# Altium schematic sheet 9.AUX.SchDoc: 6.6kW Daul OBC +11kW WPT
size A3; Date: 23/03/6; Revision: V 1.0; SheetNumber: 14; SheetTotal: 14; PageSetup: Record=PageOptions|CenterHorizontal=True|CenterVertical=True|PrintScale=0.71|XCorrection=1.00|YCorrection=1.00|PrintKind=2|BorderSize=5000000|LeftOffset=0|BottomOffset=0|Orientation=2|PaperLength=1000|PaperWidth=1000|Scale=100|PaperSource=7|PrintQuality=-3|MediaType=1|DitherType=10|PrintScaleMode=1|PaperKind=A4|PaperIndex=9; ImagePath: 0
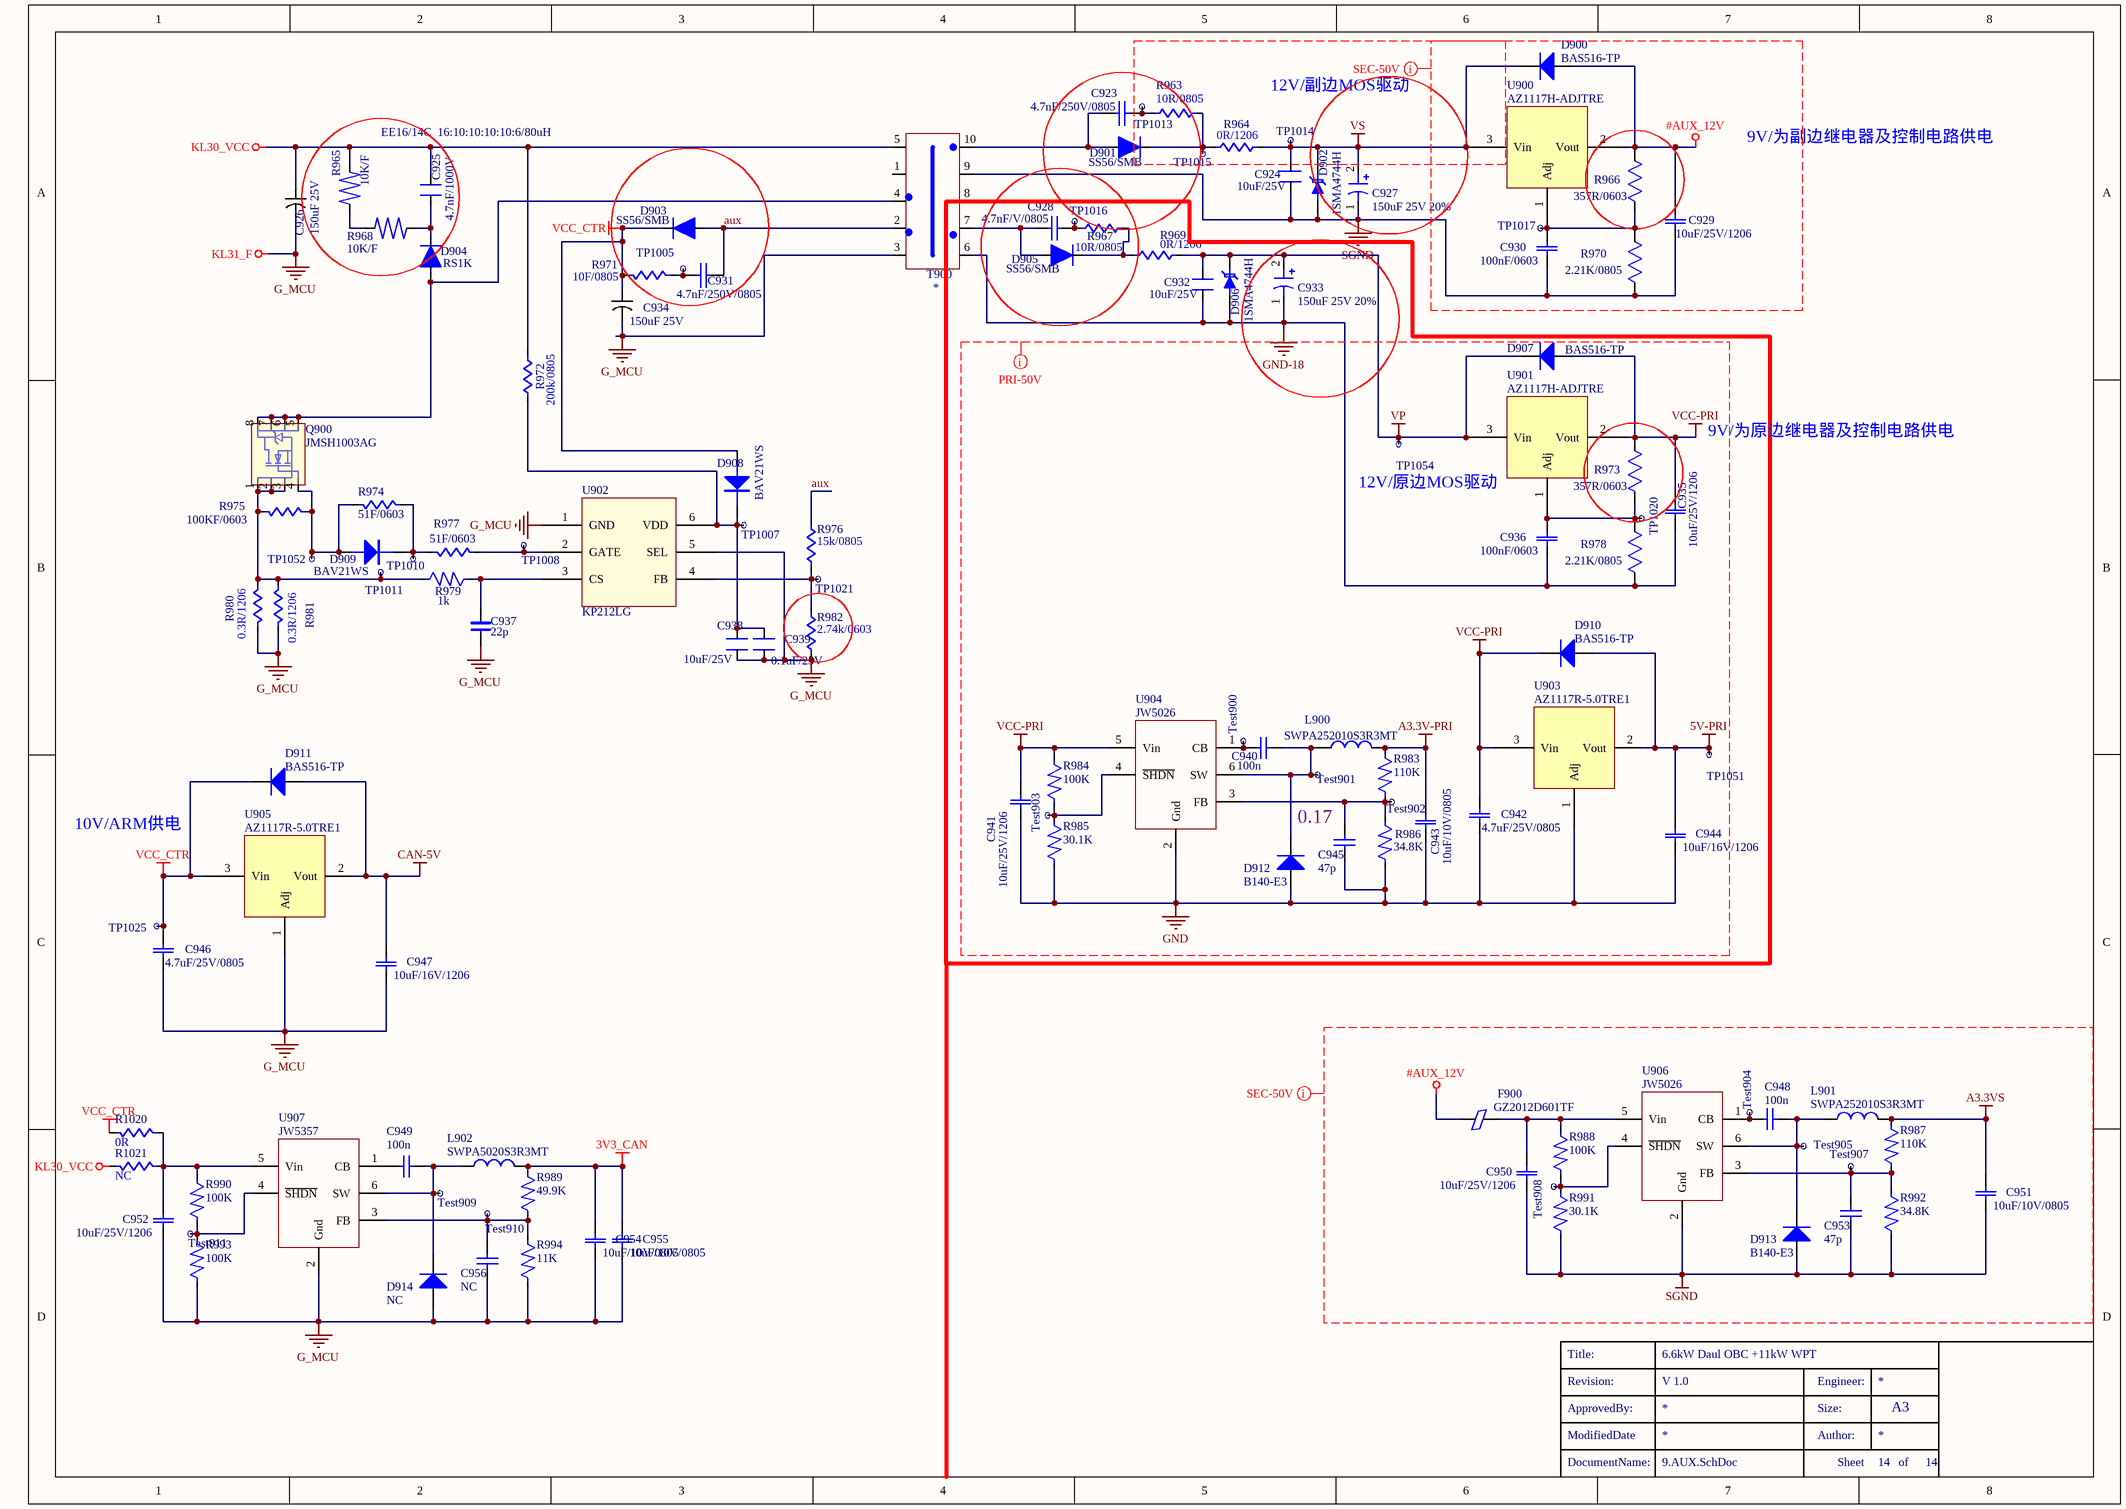
[diagram p0: 9.AUX.SchDoc]

## Parts
C923  4.7nF/250V/0805  [C0805]
C924  10uF/25V  [C1206]
C925  4.7nF/1000V  [C1206]
C926  150uF 25V  [CE_D6_3_L7_7_MVY]
C927  150uF 25V 20%  [CE_D6_3_L7_7_MVY]
C928  4.7nF/V/0805  [C0805]
C929  10uF/25V/1206  [C1206]
C930  100nF/0603  [C0603]
C931  4.7nF/250V/0805  [C0805]
C932  10uF/25V  [C1206]
C933  150uF 25V 20%  [CE_D6_3_L7_7_MVY]
C934  150uF 25V  [CE_D6_3_L7_7_MVY]
C935  10uF/25V/1206  [C1206]
C936  100nF/0603  [C0603]
C937  22p  [C0603]
C938  10uF/25V  [C0805]
C939  0.1uF/25V  [C0603]
C940  100n  [C0402]
C941  10uF/25V/1206  [C1206]
C942  4.7uF/25V/0805  [C0805]
C943  10uf/10V/0805  [C0805]
C944  10uF/16V/1206  [C1206]
C945  47p  [C0402]
C946  4.7uF/25V/0805  [C0805]
C947  10uF/16V/1206  [C1206]
C948  100n  [C0402]
C949  100n  [C0402]
C950  10uF/25V/1206  [C1206]
C951  10uf/10V/0805  [C0805]
C952  10uF/25V/1206  [C1206]
C953  47p  [C0402]
C954  10uf/10V/0805  [C0805]
C955  10uf/10V/0805  [C0805]
C956  NC  [C0402]
D900  BAS516-TP  [D_SOD-523_SC-79]
D901  value SS56/SMB  [DO-214AC]  (hidden comment: ES1J)
D902  1SMA4744H  [DO-214AC]
D903  value SS56/SMB  [DO-214AC]  (hidden comment: ES1J)
D904  RS1K  [DO-214AC]
D905  value SS56/SMB  [DO-214AC]  (hidden comment: ES1J)
D906  1SMA4744H  [DO-214AC]
D907  BAS516-TP  [D_SOD-523_SC-79]
D908  BAV21WS  [D_SOD323]
D909  BAV21WS  [D_SOD323]
D910  BAS516-TP  [D_SOD-523_SC-79]
D911  BAS516-TP  [D_SOD-523_SC-79]
D912  B140-E3  [DO-214AC]
D913  B140-E3  [D_SMA]
D914  NC  [D_SMA]
F900  GZ2012D601TF  [R0805]
L900  SWPA252010S3R3MT  [SWPA252010S]
L901  SWPA252010S3R3MT  [SWPA252010S]
L902  SWPA5020S3R3MT  [IND-SMD_L5.0-W5.0]
Q900  JMSH1003AG  [Q_PG_TDSON_8]
R963  10R/0805  [R0805]
R964  0R/1206  [R1206]
R965  10K/F  [R1206]
R966  357R/0603  [R0603]
R967  10R/0805  [R0805]
R968  10K/F  [R1206]
R969  0R/1206  [R1206]
R970  2.21K/0805  [R0805]
R971  10F/0805  [R1206]
R972  200k/0805  [R0805]
R973  357R/0603  [R0603]
R974  51F/0603  [R0603]
R975  100KF/0603  [R0603]
R976  15k/0805  [R0805]
R977  51F/0603  [R0603]
R978  2.21K/0805  [R0805]
R979  1k  [R0603]
R980  0.3R/1206  [R1206]
R981  0.3R/1206  [R1206]
R982  2.74k/0603  [R0603]
R983  110K  [R0402]
R984  100K  [R0402]
R985  30.1K  [R0402]
R986  34.8K  [R0402]
R987  110K  [R0402]
R988  100K  [R0402]
R989  49.9K  [R0402]
R990  100K  [R0402]
R991  30.1K  [R0402]
R992  34.8K  [R0402]
R993  100K  [R0402]
R994  11K  [R0402]
R1020  0R  [R1206]
R1021  NC  [R1206]
T900  定制磁件  [BOBBIN_10P_EI_25]  (value not drawn)
Test900  测试点  [测试点]  (value not drawn)
Test901  测试点  [测试点]  (value not drawn)
Test902  测试点  [测试点]  (value not drawn)
Test903  测试点  [测试点]  (value not drawn)
Test904  测试点  [测试点]  (value not drawn)
Test905  测试点  [测试点]  (value not drawn)
Test907  测试点  [测试点]  (value not drawn)
Test908  测试点  [测试点]  (value not drawn)
Test909  测试点  [测试点]  (value not drawn)
Test910  测试点  [测试点]  (value not drawn)
Test911  测试点  [测试点]  (value not drawn)
TP1005  测试点  [测试点]  (value not drawn)
TP1007  测试点  [测试点]  (value not drawn)
TP1008  测试点  [测试点]  (value not drawn)
TP1010  测试点  [测试点]  (value not drawn)
TP1011  测试点  [测试点]  (value not drawn)
TP1013  测试点  [测试点]  (value not drawn)
TP1014  测试点  [测试点]  (value not drawn)
TP1015  测试点  [测试点]  (value not drawn)
TP1016  测试点  [测试点]  (value not drawn)
TP1017  测试点  [测试点]  (value not drawn)
TP1020  测试点  [测试点]  (value not drawn)
TP1021  测试点  [测试点]  (value not drawn)
TP1025  测试点  [测试点]  (value not drawn)
TP1051  测试点  [测试点]  (value not drawn)
TP1052  测试点  [测试点]  (value not drawn)
TP1054  测试点  [测试点]  (value not drawn)
U900  AZ1117H-ADJTRE  [SOT-223]
U901  AZ1117H-ADJTRE  [SOT-223]
U902  KP212LG  [SOT-23_6]
U903  AZ1117R-5.0TRE1  [SOT89_MI]
U904  JW5026  [SOT-23_6]
U905  AZ1117R-5.0TRE1  [SOT89_MI]
U906  JW5026  [SOT-23_6]
U907  JW5357  [SOT-23_6]

## Blocks framed on the sheet
0.17: C928 C932 C933 C935 C936 C940-C945 D905-D907 D910 D912 L900 R967 R969 R973 R978 R983-R986 Test900-Test903 TP1016 TP1020 TP1051 TP1054 U901 U903 U904

## Nets
3V3_CAN: C954.2 C955.2 L902.2 R989.1
5V-PRI: C944.2 D910.A TP1051.1 U903.2(Vout)
#AUX_12V: C929.2 D900.A F900.1 R966.1 U900.2(Vout)
A3.3V-PRI: C943.2 L900.2 R983.1
A3.3VS: C951.2 L901.2 R987.1
CAN-5V: C947.2 D911.A U905.2(Vout)
G_MCU: C926.1(-) C934.1(-) C937.2 C938.2 C939.2 C946.1 C947.1 C952.1 C954.1 C955.1 C956.1 D914.A R980.1 R981.1 R982.1 R993.2 R994.2 T900.3 U902.1(GND) U902.5(SEL) U905.1(Adj) U907.2(Gnd)  [also labelled KL31_F]
GND: C941.1 C942.1 C943.1 C944.1 C945.1 D912.A R985.2 R986.2 U903.1(Adj) U904.2(Gnd)
GND-18: C932.1 C933.1 C935.1 C936.2 D906.A R978.2 T900.6
KL30_VCC: C925.2 C926.2(+) R965.2 R972.1 R1021.2 T900.5
SGND: C924.1 C927.1 C929.1 C930.2 C950.1 C951.1 C953.1 D902.A D913.A R970.2 R991.2 R992.2 T900.9 U906.2(Gnd)
VCC-PRI: C935.2 C941.2 C942.2 D907.A D910.K R973.1 R984.1 U901.2(Vout) U903.3(Vin) U904.5(Vin)
VCC_CTR: C934.2(+) C946.2 D903.K D908.A D911.K R971.1 R1020.2 TP1025.1 U905.3(Vin)
VP: C932.2 C933.2 D906.K D907.K R969.2 TP1054.1 U901.3(Vin)
VS: C924.2 C927.2 D900.K D902.K R964.2 TP1014.1 U900.3(Vin)
aux: C931.1 D903.A R976.2 T900.2
NetC923_1: C923.1 D901.A T900.10
NetC923_2: C923.2 R963.1 TP1013.1
NetC925_1: C925.1 D904.K R968.1
NetC928_1: C928.1 D905.A T900.7
NetC928_2: C928.2 R967.1 TP1016.1
NetC930_1: C930.1 R966.2 R970.1 TP1017.1 U900.1(Adj)
NetC931_2: C931.2 R971.2 TP1005.1
NetC936_1: C936.1 R973.2 R978.1 TP1020.1 U901.1(Adj)
NetC937_1: C937.1 R979.1 U902.3(CS)
NetC938_1: C938.1 C939.1 D908.K R972.2 TP1007.1 U902.6(VDD)
NetC940_1: C940.1 D912.K L900.1 Test901.1 U904.6(SW)
NetC940_2: C940.2 Test900.1 U904.1(CB)
NetC945_2: C945.2 R983.2 R986.1 Test902.1 U904.3(FB)
NetC948_1: C948.1 D913.K L901.1 Test905.1 U906.6(SW)
NetC948_2: C948.2 Test904.1 U906.1(CB)
NetC949_1: C949.1 D914.K L902.1 Test909.1 U907.6(SW)
NetC949_2: C949.2 U907.1(CB)
NetC950_2: C950.2 F900.2 R988.1 U906.5(Vin)
NetC952_2: C952.2 R990.1 R1020.1 R1021.1 U907.5(Vin)
NetC953_2: C953.2 R987.2 R992.1 Test907.1 U906.3(FB)
NetC956_2: C956.2 R989.2 R994.1 Test910.1 U907.3(FB)
NetD901_K: D901.K R963.2 R964.1 TP1015.1
NetD904_A: D904.A Q900.5(D) Q900.6(D) Q900.7(D) Q900.8(D) T900.4
NetD905_K: D905.K R967.2 R969.1
NetD909_A: D909.A Q900.4(G) R974.2 R975.2 TP1052.1
NetD909_K: D909.K R974.1 R977.2 TP1010.1
NetQ900_1: Q900.1(S) Q900.2(S) Q900.3(S) R975.1 R979.2 R980.2 R981.2 TP1011.1
NetR965_1: R965.1 R968.2
NetR976_1: R976.1 R982.2 TP1021.1 U902.4(FB)
NetR977_1: R977.1 TP1008.1 U902.2(GATE)
NetR984_2: R984.2 R985.1 Test903.1 U904.4(~{SHDN})
NetR988_2: R988.2 R991.1 Test908.1 U906.4(~{SHDN})
NetR990_2: R990.2 R993.1 Test911.1 U907.4(~{SHDN})

Not connected (* = marked no-connect by the designer): T900 1 8

## Layout directives
net class SEC-50V: #AUX_12V, A3.3VS, SGND
net class PRI-50V: 5V-PRI, A3.3V-PRI, GND, VCC-PRI, VP

## Notes on the sheet
- 12V/副边MOS驱动
- EE16/14C  16:10:10:10:10:6/80uH
- 9V/为副边继电器及控制电路供电
- 9V/为原边继电器及控制电路供电
- (near TP1054) 12V/原边MOS驱动
- 10V/ARM供电
- Revision:
- Title:
- Engineer:
- ModifiedDate
- ApprovedBy:
- Author:
- Size:
- A3
- DocumentName:
- Sheet
- of
- (in symbol CAP0603) 10uF/10V/0805

## Library data of the parts
C923 C928 C931 = C0805: Capacitor SMD
C924 C925 C932 C938 C939 = C-A: Chip
  C924 C932 C938: Value: 10uF/25V
  C925: Value: 4.7nF/1000V
  C939: Value: 0.1uF/25V
C926 C934 = CAP AL
C927 C933 = CAP_Ecap: Manufacturer: Panasonic; Manufacturer P/N: EEEFK1E151P; DIP/SMD: SMD
C929 C930 C935 C936 = CAP0603: Manufacturer: {Manufacturer}; Manufacturer P/N: {Manufacturer P/N}; Package: {Package}
  C929 C935: VALUE: 10uF/25V/1206
  C930 C936: VALUE: 100nF/0603
C937 = CAP_GENERAL: VALUE: 22p
C940 C945 C948 C949 C953 C956 = CAP
  C940 C948 C949: VALUE: 100n
  C945 C953: VALUE: 47p
  C956: VALUE: NC
C941-C944 C946 C947 C950-C952 C954 C955 = CAP0603: Manufacturer: {Manufacturer}; Manufacturer P/N: {Manufacturer P/N}; DIP/SMD: SMD; Top/Bottom: Top; Package: {Package}; Part Number: *
  C941 C950 C952: VALUE: 10uF/25V/1206
  C942 C946: VALUE: 4.7uF/25V/0805
  C944 C947: VALUE: 10uF/16V/1206
D900 D907 = DIODE_MICRO: DIODE RECTIFIER; VALUE: BAS516-TP
D901 D903-D905 = D-DO214AC-A
  D904: Value: RS1K
D902 D906 = TVS: Manufacturer: Taiwan Semiconductor; DIP/SMD: SMD; Manufacturer P/N: 1SMA4744H
D908 D909 = DIODE
D910 D911 = DIODE_MICRO: 75V 250mA SOD-523 MCC; DIP/SMD: SMD; Top/Bottom: Top; VALUE: BAS516-TP; Part Number: *
D912-D914 = DIODE_MICRO: DIODE RECTIFIER; DIP/SMD: SMD; Top/Bottom: Bottom; BQ-CCCP: BQ-CCCP
  D912 D913: VALUE: B140-E3
  D914: VALUE: NC
F900 = Ferrite Bead 220±25％Ω@100MHz 2.2A 0.05Ω F0603_0.95 BLM18KG221SH1D(Murata): 厂商: MURATA; 品名: Ferrite Bead 220±25％Ω@100MHz 2.2A 0.05Ω F0603_0.95, Murata#BLM18KG221SH1D; 料号: 90-E03L0006; Qualified: AEC-Q200; 温度范围: -55℃~﹢125℃; 重量: 0.005g; 值: 600Ω; 规格: BLM18KG221SH1D(Murata); BCS料号: *; 耐压值: *
L900-L902 = INDU_GENERAL
  L900 L901: VALUE: SWPA252010S3R3MT
  L902: VALUE: SWPA5020S3R3MT
Q900 = NMOS_POW_8: Infinion N_MOS 8PIN
R963 R964 R967 R969 R971 R972 R976 R980-R982 R1020 R1021 = R1206: Resistance: *; Package: 1206
R965 R968 = R-A: Value: 10K/F
R966 R970 R973 R978 = RES0603: RES0402; Manufacturer: Yageo; Manufacturer P/N: 9C06031A0R00JLHFT; OriginalName: RES1; ComponentField6: Published 8-Jun-2000; Distributor: Digikey; Distributor P/N: 311-0.0GCT-ND
  R966 R973: VALUE: 357R/0603
  R970 R978: VALUE: 2.21K/0805
R974 R975 R977 = R0603
R979 = RESISTOR_0805: RESISTOR; DIP/SMD: SMD; Top/Bottom: Bottom; VALUE: 1k; Part Number: *
R983-R994 = RESISTOR
  R983 R987: VALUE: 110K
  R984 R988 R990 R993: VALUE: 100K
  R985 R991: VALUE: 30.1K
  R986 R992: VALUE: 34.8K
  R989: VALUE: 49.9K
  R994: VALUE: 11K
T900 = BOBBIN_5+5: VALUE: *
U900 U901 = Component_1: VALUE: AZ1117H-ADJTRE
U903 U905 = Component_1: LDO 1.25-20V SOT-223 EXAR; DIP/SMD: SMD; Top/Bottom: Top; VALUE: AZ1117R-5.0TRE1; Part Number: *
U904 U906 U907 = LMR16006
  U904 U906: VALUE: JW5026
  U907: VALUE: JW5357